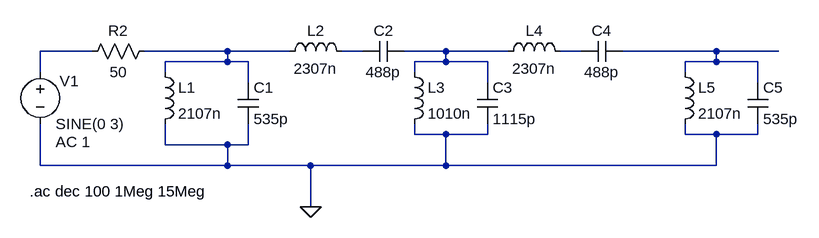
[diagram p0: schematic bandpass_filter.asc]
bandpass_filter.asc, the LTspice schematic file:
Version 4
SHEET 1 1288 680
WIRE 192 208 112 208
WIRE 400 208 272 208
WIRE 496 208 400 208
WIRE 608 208 576 208
WIRE 736 208 672 208
WIRE 832 208 736 208
WIRE 944 208 912 208
WIRE 1152 208 1008 208
WIRE 1248 208 1152 208
WIRE 400 224 400 208
WIRE 400 224 304 224
WIRE 432 224 400 224
WIRE 736 224 736 208
WIRE 736 224 688 224
WIRE 800 224 736 224
WIRE 1152 224 1152 208
WIRE 1152 224 1104 224
WIRE 1216 224 1152 224
WIRE 112 240 112 208
WIRE 304 240 304 224
WIRE 688 240 688 224
WIRE 1104 240 1104 224
WIRE 432 256 432 224
WIRE 800 256 800 224
WIRE 1216 256 1216 224
WIRE 688 336 688 320
WIRE 736 336 688 336
WIRE 800 336 800 320
WIRE 800 336 736 336
WIRE 1104 336 1104 320
WIRE 1152 336 1104 336
WIRE 1216 336 1216 320
WIRE 1216 336 1152 336
WIRE 304 352 304 320
WIRE 400 352 304 352
WIRE 432 352 432 320
WIRE 432 352 400 352
WIRE 112 384 112 320
WIRE 400 384 400 352
WIRE 400 384 112 384
WIRE 528 384 400 384
WIRE 736 384 736 336
WIRE 736 384 528 384
WIRE 1152 384 1152 336
WIRE 1152 384 736 384
WIRE 528 448 528 384
FLAG 528 448 0
DATAFLAG 1200 208 ""
SYMBOL voltage 112 224 R0
WINDOW 0 30 30 Left 2
WINDOW 123 24 124 Left 2
WINDOW 39 0 0 Left 0
SYMATTR InstName V1
SYMATTR Value SINE(0 3)
SYMATTR Value2 AC 1
SYMBOL ind 288 224 R0
SYMATTR InstName L1
SYMATTR Value 2107n
SYMBOL ind 672 224 R0
SYMATTR InstName L3
SYMATTR Value 1010n
SYMBOL cap 416 256 R0
SYMATTR InstName C1
SYMATTR Value 535p
SYMBOL cap 784 256 R0
SYMATTR InstName C3
SYMATTR Value 1115p
SYMBOL cap 672 192 R90
WINDOW 0 0 32 VBottom 2
WINDOW 3 32 32 VTop 2
SYMATTR InstName C2
SYMATTR Value 488p
SYMBOL ind 480 224 R270
WINDOW 0 32 56 VTop 2
WINDOW 3 5 56 VBottom 2
SYMATTR InstName L2
SYMATTR Value 2307n
SYMBOL res 288 192 R90
WINDOW 0 0 56 VBottom 2
WINDOW 3 32 56 VTop 2
SYMATTR InstName R2
SYMATTR Value 50
SYMBOL ind 1088 224 R0
SYMATTR InstName L5
SYMATTR Value 2107n
SYMBOL cap 1200 256 R0
SYMATTR InstName C5
SYMATTR Value 535p
SYMBOL cap 1008 192 R90
WINDOW 0 0 32 VBottom 2
WINDOW 3 32 32 VTop 2
SYMATTR InstName C4
SYMATTR Value 488p
SYMBOL ind 816 224 R270
WINDOW 0 32 56 VTop 2
WINDOW 3 5 56 VBottom 2
SYMATTR InstName L4
SYMATTR Value 2307n
TEXT 96 424 Left 2 !.ac dec 100 1Meg 15Meg

The netlist it stands for:
* bandpass_filter.asc
V1 N001 0 SINE(0 3) AC 1
L1 N002 0 2107n
L3 N004 0 1010n
C1 N002 0 535p
C3 N004 0 1115p
C2 N004 N003 488p
L2 N002 N003 2307n
R2 N002 N001 50
L5 N006 0 2107n
C5 N006 0 535p
C4 N006 N005 488p
L4 N004 N005 2307n
.ac dec 100 1Meg 15Meg
.backanno
.end